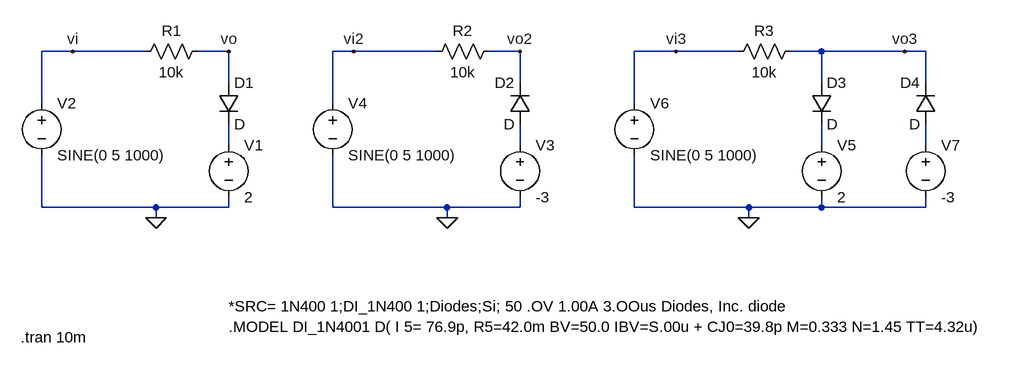
[diagram p0: schematic ECE3060_Exp7_clippercircuits.asc]
ECE3060_Exp7_clippercircuits.asc, the LTspice schematic file:
Version 4
SHEET 1 1544 680
WIRE 32 48 -16 48
WIRE 144 48 32 48
WIRE 272 48 224 48
WIRE 464 48 432 48
WIRE 592 48 464 48
WIRE 720 48 672 48
WIRE 960 48 896 48
WIRE 1056 48 960 48
WIRE 1184 48 1136 48
WIRE 1312 48 1184 48
WIRE 1344 48 1312 48
WIRE 272 96 272 48
WIRE 720 96 720 48
WIRE 1184 96 1184 48
WIRE 1344 96 1344 48
WIRE -16 128 -16 48
WIRE 432 128 432 48
WIRE 896 128 896 48
WIRE 272 192 272 160
WIRE 720 192 720 160
WIRE 1184 192 1184 160
WIRE 1344 192 1344 160
WIRE -16 288 -16 208
WIRE 160 288 -16 288
WIRE 272 288 272 272
WIRE 272 288 160 288
WIRE 432 288 432 208
WIRE 608 288 432 288
WIRE 720 288 720 272
WIRE 720 288 608 288
WIRE 896 288 896 208
WIRE 1072 288 896 288
WIRE 1184 288 1184 272
WIRE 1184 288 1072 288
WIRE 1344 288 1344 272
WIRE 1344 288 1184 288
WIRE 160 304 160 288
WIRE 608 304 608 288
WIRE 1072 304 1072 288
FLAG 160 304 0
FLAG 608 304 0
FLAG 1072 304 0
FLAG 32 48 vi
FLAG 464 48 vi2
FLAG 960 48 vi3
FLAG 272 48 vo
FLAG 720 48 vo2
FLAG 1312 48 vo3
SYMBOL res 240 32 R90
WINDOW 0 0 56 VBottom 2
WINDOW 3 32 56 VTop 2
SYMATTR InstName R1
SYMATTR Value 10k
SYMBOL diode 256 96 R0
SYMATTR InstName D1
SYMBOL voltage 272 176 R0
WINDOW 123 0 0 Left 0
WINDOW 39 0 0 Left 0
SYMATTR InstName V1
SYMATTR Value 2
SYMBOL voltage -16 112 R0
WINDOW 123 0 0 Left 0
WINDOW 39 0 0 Left 0
SYMATTR InstName V2
SYMATTR Value SINE(0 5 1000)
SYMBOL res 688 32 R90
WINDOW 0 0 56 VBottom 2
WINDOW 3 32 56 VTop 2
SYMATTR InstName R2
SYMATTR Value 10k
SYMBOL diode 736 160 R180
WINDOW 0 24 64 Left 2
WINDOW 3 24 0 Left 2
SYMATTR InstName D2
SYMBOL voltage 720 176 R0
WINDOW 123 0 0 Left 0
WINDOW 39 0 0 Left 0
SYMATTR InstName V3
SYMATTR Value -3
SYMBOL voltage 432 112 R0
WINDOW 123 0 0 Left 0
WINDOW 39 0 0 Left 0
SYMATTR InstName V4
SYMATTR Value SINE(0 5 1000)
SYMBOL res 1152 32 R90
WINDOW 0 0 56 VBottom 2
WINDOW 3 32 56 VTop 2
SYMATTR InstName R3
SYMATTR Value 10k
SYMBOL diode 1168 96 R0
SYMATTR InstName D3
SYMBOL voltage 1184 176 R0
WINDOW 123 0 0 Left 0
WINDOW 39 0 0 Left 0
SYMATTR InstName V5
SYMATTR Value 2
SYMBOL voltage 896 112 R0
WINDOW 123 0 0 Left 0
WINDOW 39 0 0 Left 0
SYMATTR InstName V6
SYMATTR Value SINE(0 5 1000)
SYMBOL diode 1360 160 R180
WINDOW 0 24 64 Left 2
WINDOW 3 24 0 Left 2
SYMATTR InstName D4
SYMBOL voltage 1344 176 R0
WINDOW 123 0 0 Left 0
WINDOW 39 0 0 Left 0
SYMATTR InstName V7
SYMATTR Value -3
TEXT 272 440 Left 2 !*SRC= 1N400 1;DI_1N400 1;Diodes;Si; 50 .OV 1.00A 3.OOus Diodes, Inc. diode\n.MODEL DI_1N4001 D( I 5= 76.9p, R5=42.0m BV=50.0 IBV=S.00u + CJ0=39.8p M=0.333 N=1.45 TT=4.32u)
TEXT -48 488 Left 2 !.tran 10m

The netlist it stands for:
* ECE3060_Exp7_clippercircuits.asc
R1 vo vi 10k
D1 vo N001 D
V1 N001 0 2
V2 vi 0 SINE(0 5 1000)
R2 vo2 vi2 10k
D2 N002 vo2 D
V3 N002 0 -3
V4 vi2 0 SINE(0 5 1000)
R3 vo3 vi3 10k
D3 vo3 N003 D
V5 N003 0 2
V6 vi3 0 SINE(0 5 1000)
D4 N004 vo3 D
V7 N004 0 -3
.model D D
.lib standard.dio
*SRC= 1N400 1;DI_1N400 1;Diodes;Si; 50 .OV 1.00A 3.OOus Diodes, Inc. diode
.MODEL DI_1N4001 D( I 5= 76.9p, R5=42.0m BV=50.0 IBV=S.00u + CJ0=39.8p M=0.333 N=1.45 TT=4.32u)
.tran 10m
.backanno
.end